# EAGLE design Project (EAGLE 6.5.0)
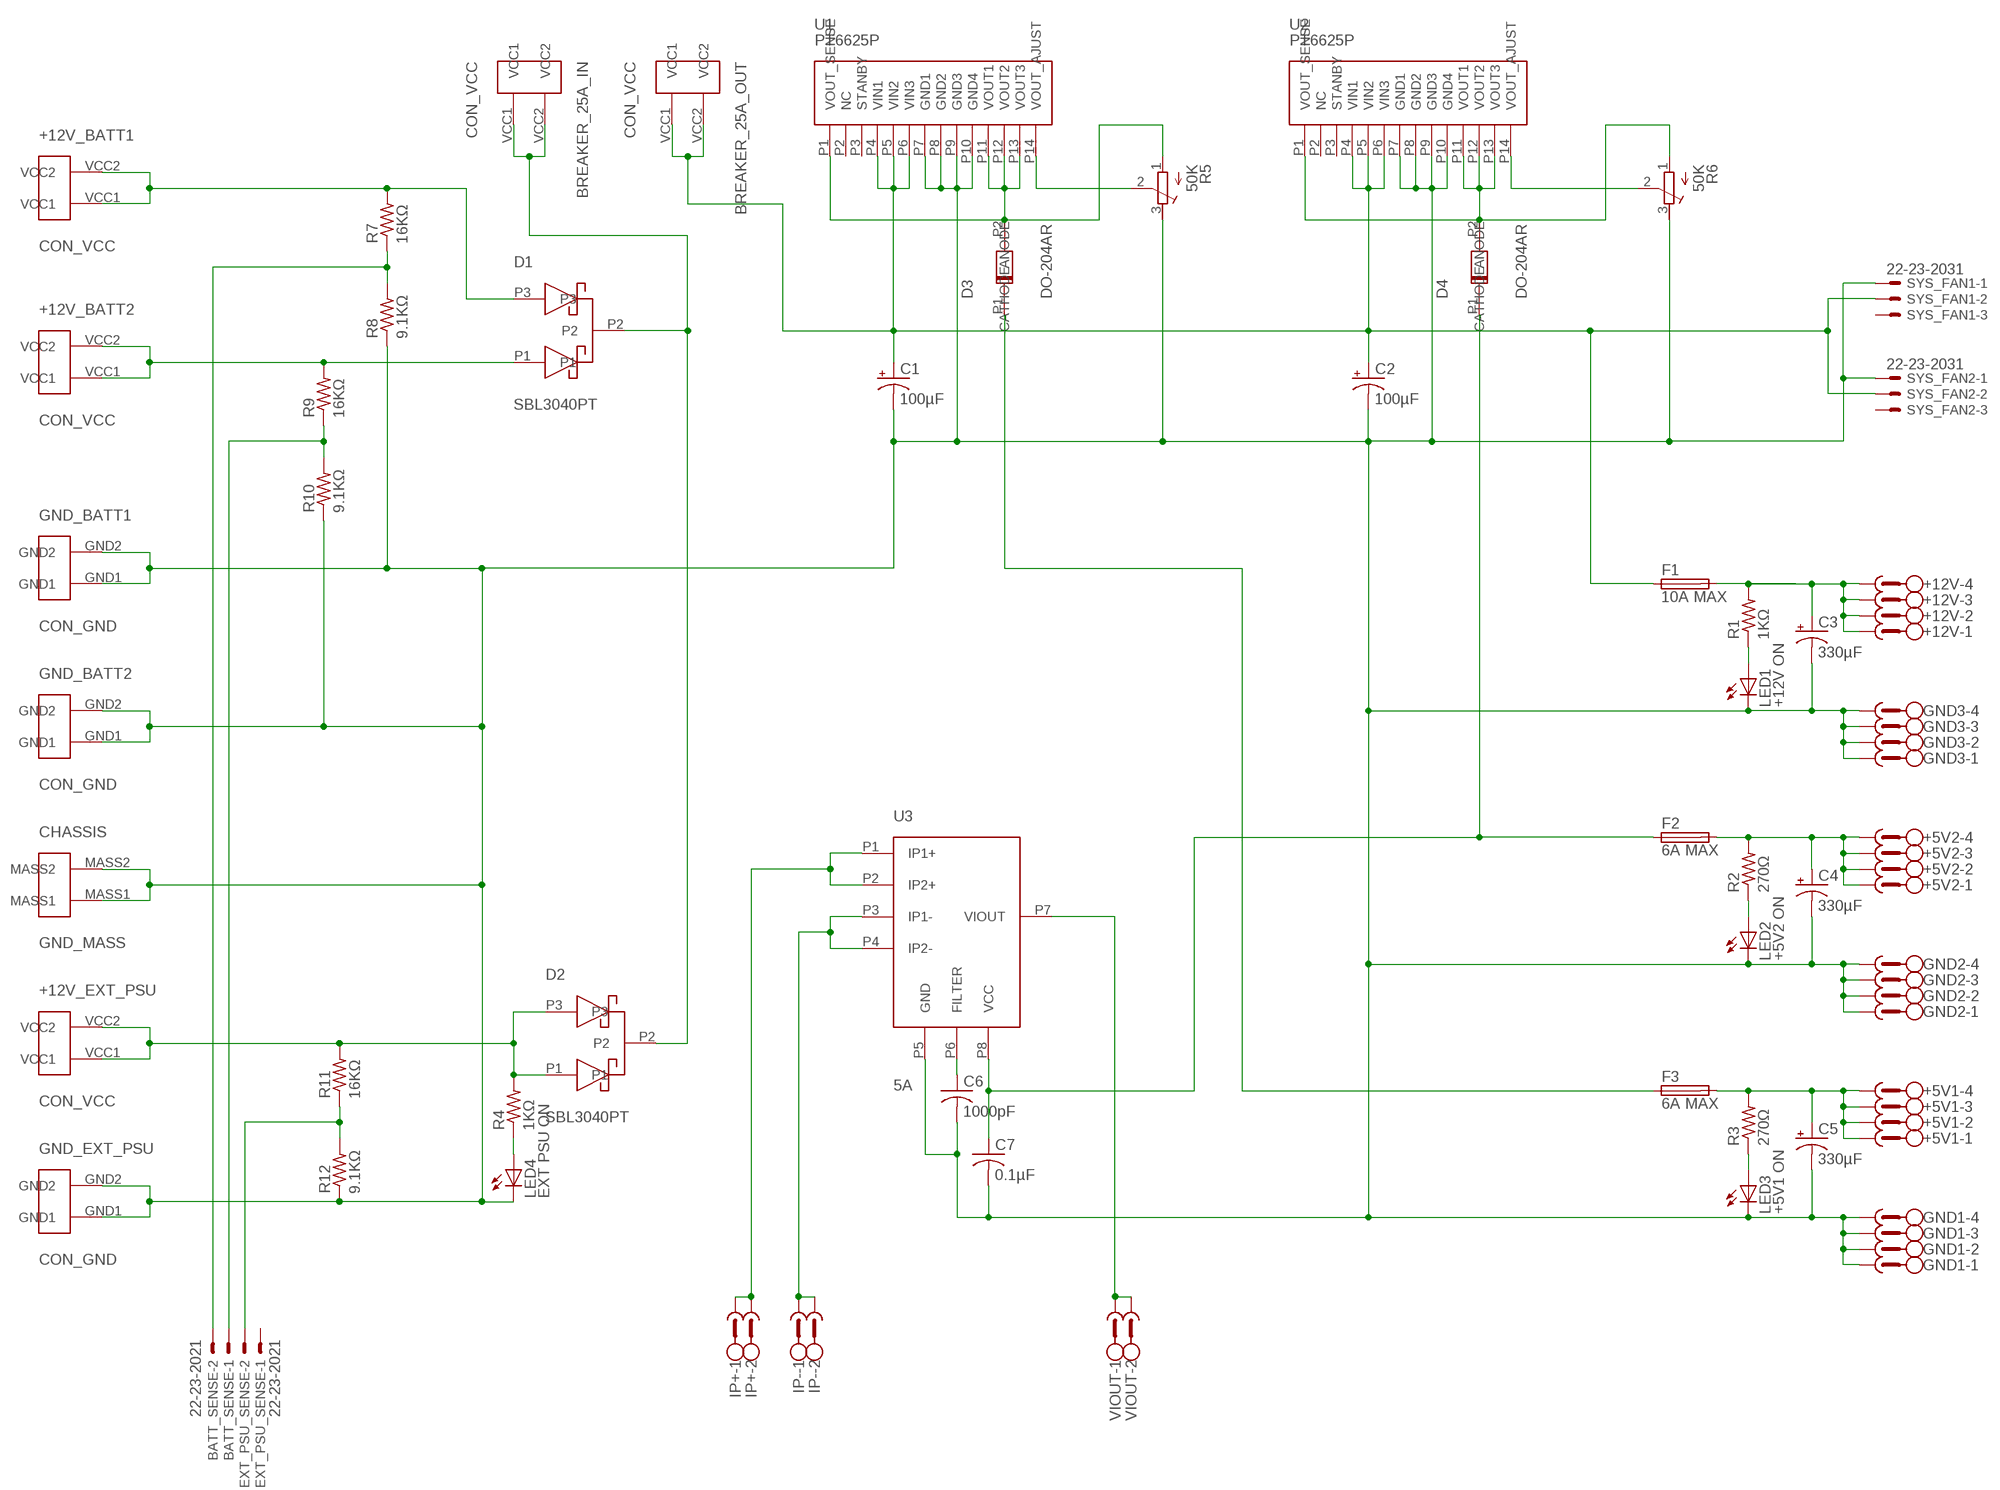
[diagram p0: schematic, sheet 1]

## Parts
+5V1  MC1.5/4-G-3.81  [MC1.5/4-G-3.81]
+5V2  MC1.5/4-G-3.81  [MC1.5/4-G-3.81]
+12V  MC1.5/4-G-3.81  [MC1.5/4-G-3.81]
+12V_BATT1  CON_VCC  [CON_VCC]
+12V_BATT2  CON_VCC  [CON_VCC]
+12V_EXT_PSU  CON_VCC  [CON_VCC]
BATT_SENSE  22-23-2021  [22-23-2021]
BREAKER_25A_IN  CON_VCC  [CON_VCC]
BREAKER_25A_OUT  CON_VCC  [CON_VCC]
C1  100µF  CPOL-USE2.5-6  [E2,5-6]
C2  100µF  CPOL-USE2.5-6  [E2,5-6]
C3  330µF  CPOL-USE5-10.5  [E5-10,5]
C4  330µF  CPOL-USE5-10.5  [E5-10,5]
C5  330µF  CPOL-USE5-10.5  [E5-10,5]
C6  1000pF  C-USC0805  [C0805]
C7  0.1µF  C-USC0805  [C0805]
CHASSIS  GND_MASS  [CON_MASS]
D1  SBL3040PT  [SBL3040PT]
D2  SBL3040PT  [SBL3040PT]
D3  DO-204AR  [DO-204AR]
D4  DO-204AR  [DO-204AR]
EXT_PSU_SENSE  22-23-2021  [22-23-2021]
F1  10A MAX  SH22,5  [SH22,5]
F2  6A MAX  SH22,5  [SH22,5]
F3  6A MAX  SH22,5  [SH22,5]
GND1  MC1.5/4-G-3.81  [MC1.5/4-G-3.81]
GND2  MC1.5/4-G-3.81  [MC1.5/4-G-3.81]
GND3  MC1.5/4-G-3.81  [MC1.5/4-G-3.81]
GND_BATT1  CON_GND  [CON_GND]
GND_BATT2  CON_GND  [CON_GND]
GND_EXT_PSU  CON_GND  [CON_GND]
IP+  MC1.5/2-G-3.81  [MC1.5/2-G-3.81]
IP-  MC1.5/2-G-3.81  [MC1.5/2-G-3.81]
LED1  +12V ON  LEDCHIP-LED0805  [CHIP-LED0805]
LED2  +5V2 ON  LEDCHIP-LED0805  [CHIP-LED0805]
LED3  +5V1 ON  LEDCHIP-LED0805  [CHIP-LED0805]
LED4  EXT PSU ON  LEDCHIP-LED0805  [CHIP-LED0805]
R1  1KΩ  R-US_M0805  [M0805]
R2  270Ω  R-US_M0805  [M0805]
R3  270Ω  R-US_M0805  [M0805]
R4  1KΩ  R-US_M0805  [M0805]
R5  50K  R-TRIMM3296Y  [RTRIM3296Y]
R6  50K  R-TRIMM3296Y  [RTRIM3296Y]
R7  16KΩ  R-US_R0805  [R0805]
R8  9.1KΩ  R-US_R0805  [R0805]
R9  16KΩ  R-US_R0805  [R0805]
R10  9.1KΩ  R-US_R0805  [R0805]
R11  16KΩ  R-US_R0805  [R0805]
R12  9.1KΩ  R-US_R0805  [R0805]
SYS_FAN1  22-23-2031  [22-23-2031]
SYS_FAN2  22-23-2031  [22-23-2031]
U1  PT6625P  [PT6625P]
U2  PT6625P  [PT6625P]
U3  5A  ACS712  [ACS712]
VIOUT  MC1.5/2-G-3.81  [MC1.5/2-G-3.81]

## Nets
GND: C1.- C2.- C3.- C4.- C5.- C6.2 C7.2 CHASSIS.MASS1 CHASSIS.MASS2 GND1.1 GND1.2 GND1.3 GND1.4 GND2.1 GND2.2 GND2.3 GND2.4 GND3.1 GND3.2 GND3.3 GND3.4 GND_BATT1.GND1 GND_BATT1.GND2 GND_BATT2.GND1 GND_BATT2.GND2 GND_EXT_PSU.GND1 GND_EXT_PSU.GND2 LED1.C LED2.C LED3.C LED4.C R5.3(A) R6.3(A) R8.1 R10.1 R12.1 SYS_FAN1.1 SYS_FAN2.1 U1.P7(GND1) U1.P8(GND2) U1.P9(GND3) U1.P10(GND4) U2.P7(GND1) U2.P8(GND2) U2.P9(GND3) U2.P10(GND4) U3.P5(GND)
N$1: LED3.A R3.1
N$2: BATT_SENSE.2 R7.1 R8.2
N$3: LED2.A R2.1
N$4: U3.P7(VIOUT) VIOUT.1 VIOUT.2
N$5: LED1.A R1.1
N$6: D4.P2(CATHODE) R6.1(E) U2.P1(VOUT_SENSE) U2.P11(VOUT1) U2.P12(VOUT2) U2.P13(VOUT3)
N$7: +12V_BATT1.VCC1 +12V_BATT1.VCC2 D1.P3 R7.2
N$8: +12V_BATT2.VCC1 +12V_BATT2.VCC2 D1.P1 R9.2
N$9: +5V2.1 +5V2.2 +5V2.3 +5V2.4 C4.+ F2.2 R2.2
N$10: BREAKER_25A_IN.VCC1 BREAKER_25A_IN.VCC2 D1.P2 D2.P2
N$11: +12V.1 +12V.2 +12V.3 +12V.4 C3.+ F1.2 R1.2
N$12: +12V_EXT_PSU.VCC1 +12V_EXT_PSU.VCC2 D2.P1 D2.P3 R4.2 R11.2
N$13: +5V1.1 +5V1.2 +5V1.3 +5V1.4 C5.+ F3.2 R3.2
N$14: LED4.A R4.1
N$15: IP-.1 IP-.2 U3.P3(IP1-) U3.P4(IP2-)
N$16: R5.2(S) U1.P14(VOUT_AJUST)
N$17: D3.P2(CATHODE) R5.1(E) U1.P1(VOUT_SENSE) U1.P11(VOUT1) U1.P12(VOUT2) U1.P13(VOUT3)
N$18: R6.2(S) U2.P14(VOUT_AJUST)
N$19: D3.P1(ANODE) F3.1
N$20: C6.1 U3.P6(FILTER)
N$21: BREAKER_25A_OUT.VCC1 BREAKER_25A_OUT.VCC2 C1.+ C2.+ F1.1 SYS_FAN1.2 SYS_FAN2.2 U1.P4(VIN1) U1.P5(VIN2) U1.P6(VIN3) U2.P4(VIN1) U2.P5(VIN2) U2.P6(VIN3)
N$22: C7.1 D4.P1(ANODE) F2.1 U3.P8(VCC)
N$23: IP+.1 IP+.2 U3.P1(IP1+) U3.P2(IP2+)
N$24: BATT_SENSE.1 R9.1 R10.2
N$25: EXT_PSU_SENSE.2 R11.1 R12.2
Unconnected: EXT_PSU_SENSE.1 SYS_FAN1.3 SYS_FAN2.3 U1.P2(NC) U1.P3(STANBY) U2.P2(NC) U2.P3(STANBY)

## Library data of the parts
+5V1 +5V2 +12V GND1-GND3 = Connecteurs_Introlab:MC1.5/4-G-3.81: Digi-Key Part Number 277-1208-ND Manufacturer Part Number 1803293 Description CONN HEADER RT ANG 4POS 3.81MM Goes with Digi-Key Part Number 277-1163-ND Manufacturer Part Number 1803594 Description CONN TERMBLOCK PLUG 4POS 3.81MM
+12V_BATT1 +12V_BATT2 +12V_EXT_PSU BREAKER_25A_IN BREAKER_25A_OUT = _Project:CON_VCC
BATT_SENSE EXT_PSU_SENSE = APC-con-molex:22-23-2021: .100" (2.54mm) Center Header - 2 Pin; MF: MOLEX; MPN: 22-23-2021; OC_FARNELL: 1462926; OC_NEWARK: 25C3832
C1-C5 = APC-resistor:CPOL-US: POLARIZED CAPACITOR, American symbol
C6 C7 = resistor:C-US: CAPACITOR, American symbol
CHASSIS = _Project:GND_MASS
D1 D2 = _Project:SBL3040PT
D3 D4 = _Project:DO-204AR
F1-F3 = APC-fuse:SH22,5: FUSE HOLDER grid 22,5 mm, OGN0031 8201, Schurter (Buerklin); MF: SCHURTER; MPN: 0031.8201; OC_FARNELL: 1162740; OC_NEWARK: 96F8317
GND_BATT1 GND_BATT2 GND_EXT_PSU = _Project:CON_GND
IP+ IP- VIOUT = Connecteurs_Introlab:MC1.5/2-G-3.81: Digi-Key Part Number 277-1206-ND Manufacturer Part Number 1803277 Description CONN HEADER RT ANG 2POS 3.81MM Goes with Digi-Key Part Number 277-1161-ND Manufacturer Part Number 1803578 Description CONN TERMBLOCK PLUG 2POS 3.81MM
LED1-LED4 = adafruit:LED: LED OSRAM: - CHIPLED LG R971, LG N971, LY N971, LG Q971, LY Q971, LO R971, LY R971 LH N974, LH R974 LS Q976, LO Q976, LY Q976 LO Q996 - Hyper CHIPLED LW Q18S LB Q993, LB Q99A, LB R99A - SideLED LS A670, LO A670, LY A670, LG A670, LP A670 LB A673, LV A673, LT A673, LW A673 LH A674 LY A675 LS A676, LA A676, LO A676, LY A676, LW A676 LS A679, LY A679, LG A679 - Hyper Micro SIDELED® LS Y876, LA Y876, LO Y876, LY Y876 LT Y87S - SmartLED LW L88C, LW L88S LB L89C, LB L89S, LG L890 LS L89K, LO L89K, LY L89K LS L896, LA L896, LO L896, LY L896 - TOPLED LS T670, LO T670, LY T670, LG T670, LP T670 LSG T670, LSP T670, LSY T670, LOP T670, LYG T670 LG T671, LOG T671, LSG T671 LB T673, LV T673, LT T673, LW T673 LH T674 LS T676, LA T676, LO T676, LY T676, LB T676, LH T676, LSB T676, LW T676 LB T67C, LV T67C, LT T67C, LS T67K, LO T67K, LY T67K, LW E67C LS E67B, LA E67B, LO E67B, LY E67B, LB E67C, LV E67C, LT E67C LW T67C LS T679, LY T679, LG T679 LS T770, LO T770, LY T770, LG T770, LP T770 LB T773, LV T773, LT T773, LW T773 LH T774 LS E675, LA E675, LY E675, LS T675 LS T776, LA T776, LO T776, LY T776, LB T776 LHGB T686 LT T68C, LB T68C - Hyper Mini TOPLED® LB M676 - Mini TOPLED Santana® LG M470 LS M47K, LO M47K, LY M47K Source: http://www.osram.convergy.de/
R1-R4 = adafruit:R-US_: RESISTOR, American symbol
R5 R6 = APC-resistor:R-TRIMM: Trimm resistor
R7-R12 = resistor:R-US_: RESISTOR, American symbol
SYS_FAN1 SYS_FAN2 = APC-con-molex:22-23-2031: .100" (2.54mm) Center Header - 3 Pin; MF: MOLEX; MPN: 22-23-2031; OC_FARNELL: 1462950; OC_NEWARK: 30C0862
U1 U2 = _Project:PT6625P
U3 = ACS712:ACS712: http://www.allegromicro.com/~/media/Files/Datasheets/ACS712-Datasheet.ashx

## Net classes
0 default: clearance 0.205 mm

## Board
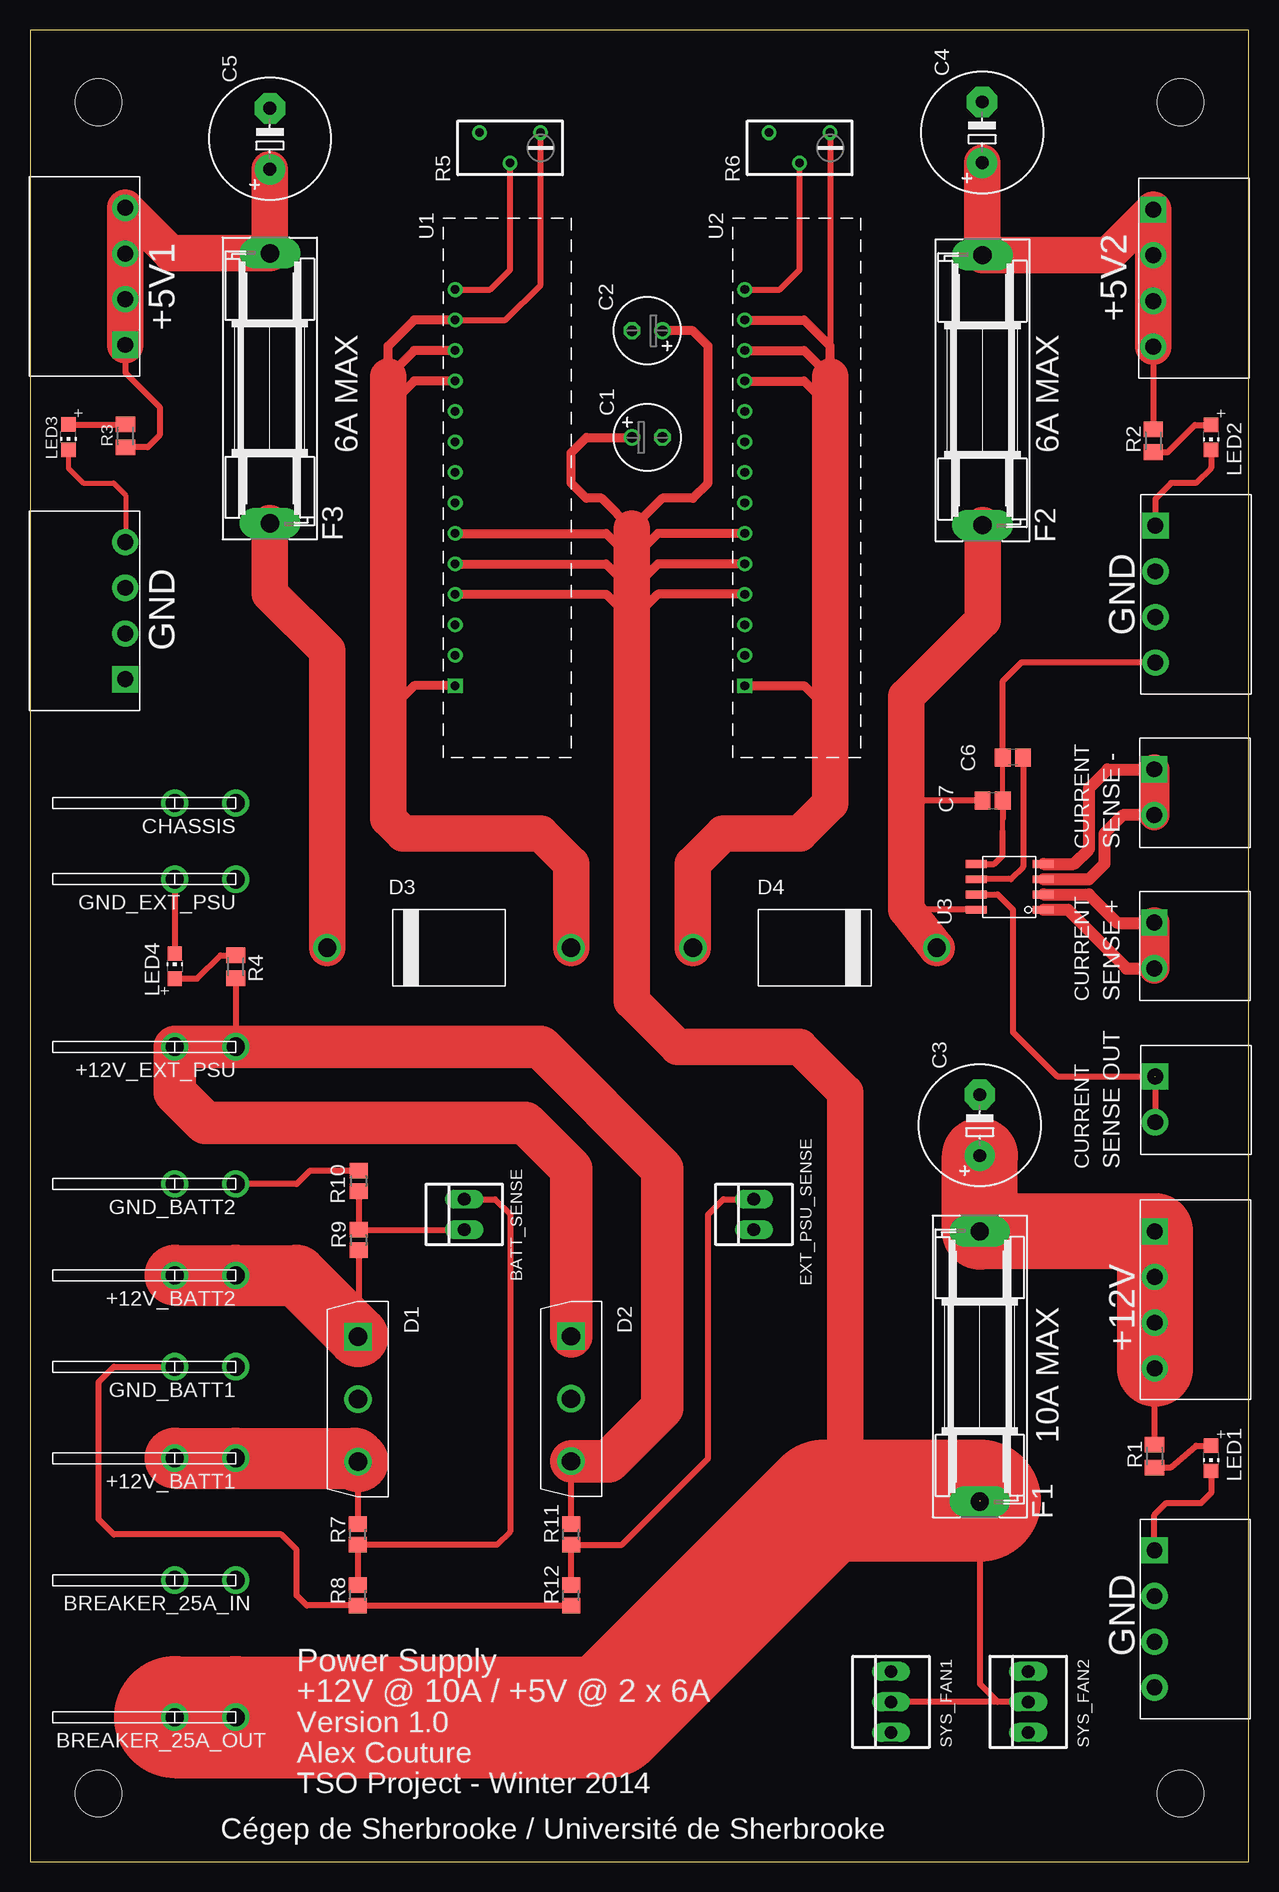
[diagram p1: board, top side]
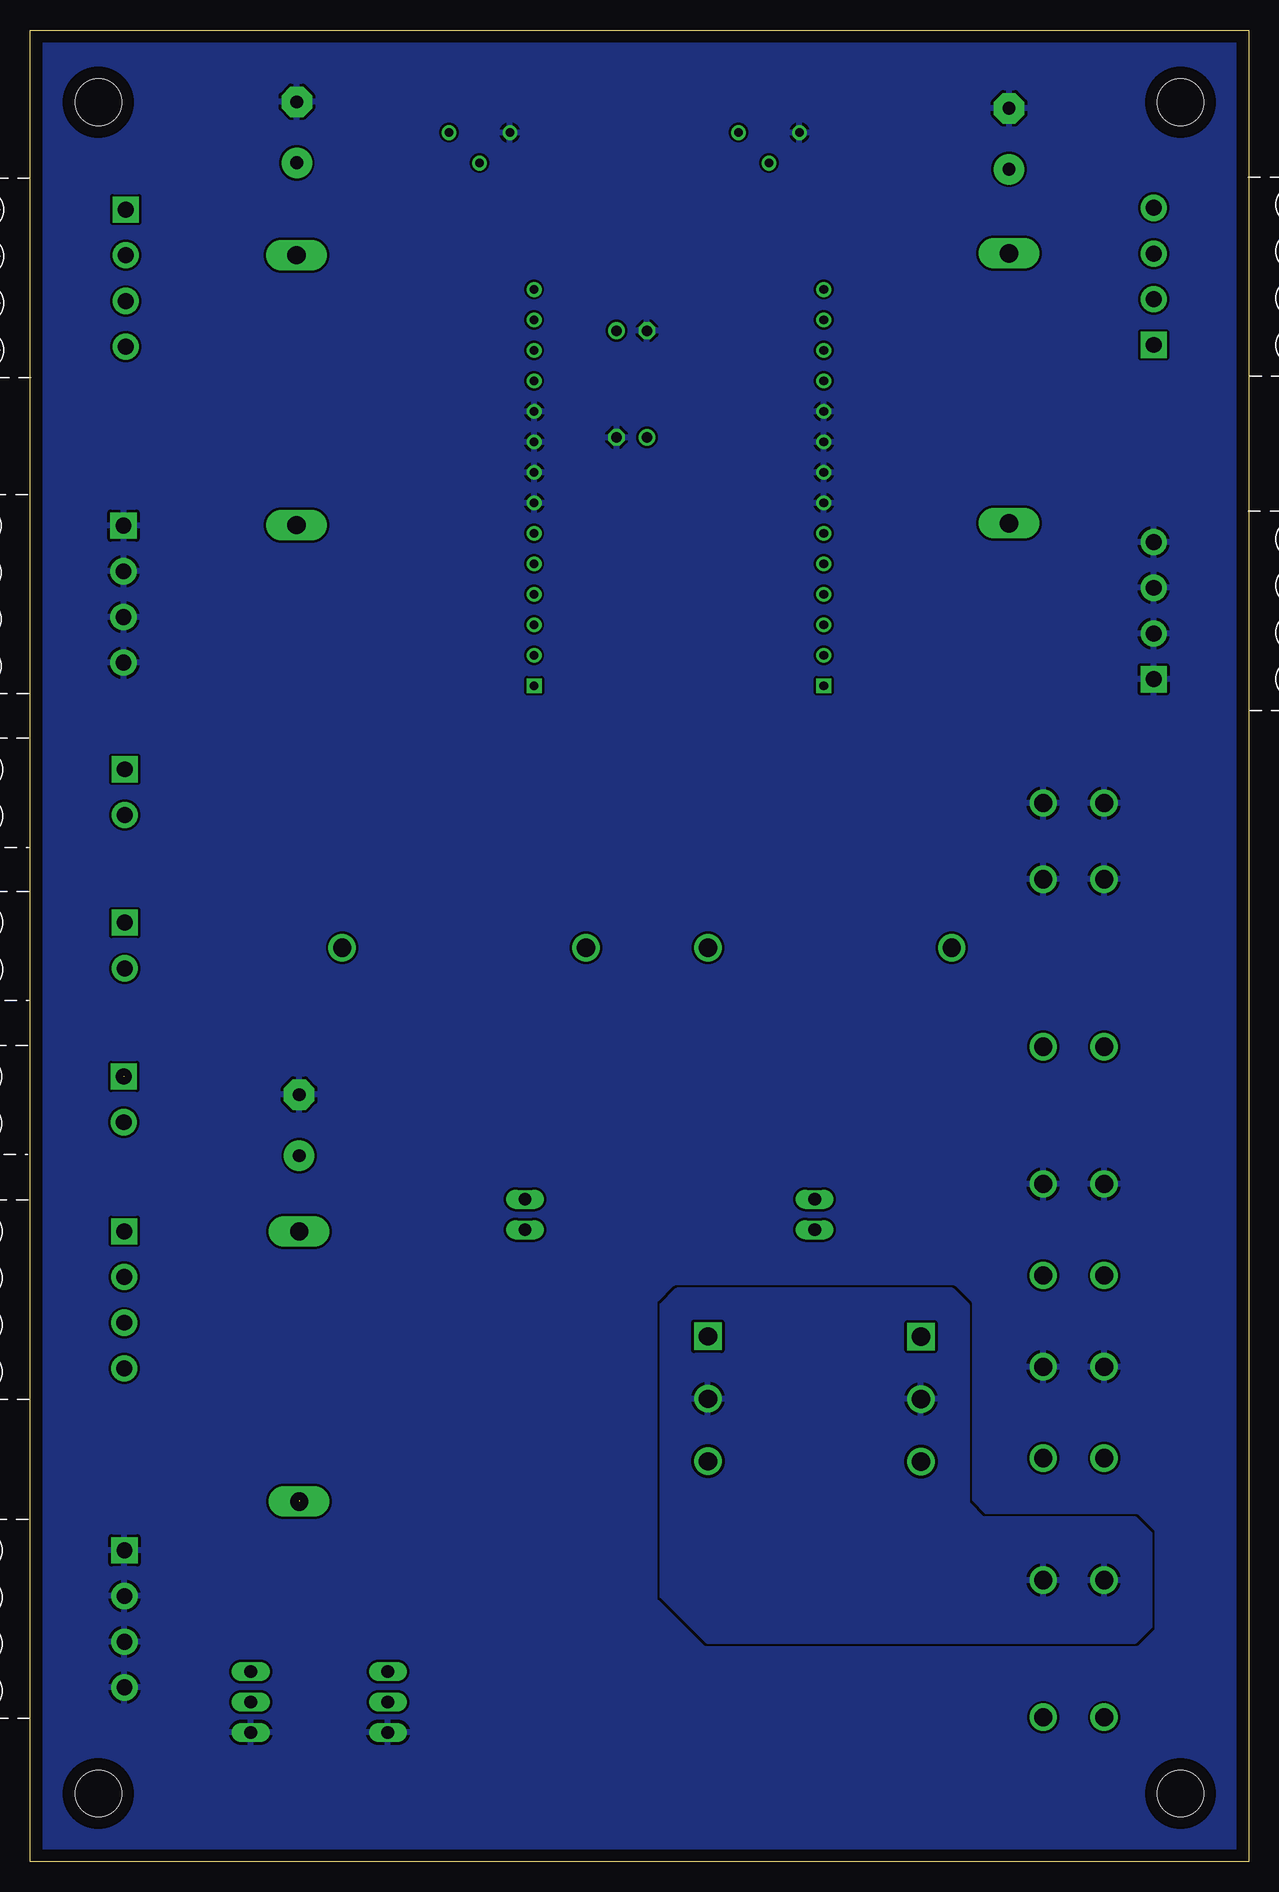
[diagram p2: board, bottom side, seen from below]

Size 101.58 x 152.71 mm. Coordinates in mm from the lower left corner, seen from the top.
Outline: 0,0 101.58,0 101.58,152.71 0,152.71 0,0
Copper layers (1*16): Top 0.035mm / dielectric 1.5mm / Bottom 0.035mm
Design rules "default *": minimum track width 10mil, minimum drill 20mil, track to track 8mil, track to pad 8mil, pad to pad 8mil, via to via 8mil, smd to smd 8mil, copper to edge 40mil, drill to drill 8mil, minimum pad ring 10mil, minimum via ring 8mil, stop-mask expansion 4mil, vias tented up to drill 0mil, thermal gap 10mil
Holes 3.86 mm at 5.71,5.71 5.71,146.69 95.89,146.69 95.89,5.71

### Footprints (pad centres in the part's own frame; a part is rotated, then mirrored left to right if it is on the bottom)
MC1.5/4-G-3.81 = drill 1.321 pad 2.184 square: 1 2.6,1.2 | drill 1.321 pad 2.184: 2 6.41,1.2; 3 10.22,1.2; 4 14.03,1.2
CON_VCC = drill 1.524: VCC1 0,0; VCC2 0,5.08
22-23-2021 = drill 1.067 long: 1 -1.27,0; 2 1.27,0
E2,5-6 = drill 0.889: + -1.27,0 | drill 0.889 octagon: - 1.27,0
E5-10,5 = drill 1.067 pad 2.54: + -2.54,0 | drill 1.067 pad 2.54 octagon: - 2.54,0
C0805 = smd 1.3 x 1.5: 1 -0.85,0; 2 0.85,0
CON_MASS = drill 1.524: MASS1 0,0; MASS2 0,5.08
SBL3040PT = drill 1.524 square: P1 0,0 | drill 1.524: P2 5.207,0; P3 10.414,0
DO-204AR = drill 1.524: P1 -10.16,3.175; P2 10.16,3.175
SH22,5 = drill 1.524 pad 2.54 long: 1 -11.252,0; 2 11.252,0
CON_GND = drill 1.524: GND1 0,0; GND2 0,5.08
MC1.5/2-G-3.81 = drill 1.321 pad 2.184 square: 1 2.6,1.2 | drill 1.321 pad 2.184: 2 6.41,1.2
CHIP-LED0805 = smd 1.2 x 1.2: A 0,-1.05; C 0,1.05
M0805 = smd 1.3 x 1.6: 1 -0.95,0; 2 0.95,0
RTRIM3296Y = drill 0.711: 1 1.27,-2.54; 2 -1.27,0; 3 1.27,2.54
R0805 = smd 1.3 x 1.5: 1 -0.85,0; 2 0.85,0
22-23-2031 = drill 1.067 long: 1 -2.54,0; 2 0,0; 3 2.54,0
PT6625P = drill 0.711 square: P1 5.969,9.652 | drill 0.711: P2 8.509,9.652; P3 11.049,9.652; P4 13.589,9.652; P5 16.129,9.652; P6 18.669,9.652; P7 21.209,9.652; P8 23.749,9.652; P9 26.289,9.652; P10 28.829,9.652; P11 31.369,9.652; P12 33.909,9.652; P13 36.449,9.652; P14 38.989,9.652
ACS712 = smd 0.65 x 1.75: P1 0,0; P2 1.27,0; P3 2.54,0; P4 3.81,0; P5 3.81,5.6; P6 2.54,5.6; P7 1.27,5.6; P8 0,5.6

### Placement (x,y rotation side)
+5V1  9.14,123.85 90 top
+5V2  92.41,140.34 270 top
+12V  92.53,55.17 270 top
+12V_BATT1  17.14,33.66 90 top
+12V_BATT2  17.14,48.89 90 top
+12V_EXT_PSU  17.14,67.94 90 top
BATT_SENSE  36.2,53.97 90 top
BREAKER_25A_IN  17.14,23.5 90 top
BREAKER_25A_OUT  17.14,12.06 90 top
C1  51.44,118.75 0 top
C2  51.44,127.64 180 top
C3  79.15,61.42 90 top
C4  79.35,144.17 90 top
C5  19.99,143.64 90 top
C6  81.92,92.08 180 top
C7  80.21,88.47 0 top
CHASSIS  17.14,88.27 90 top
D1  27.33,43.79 270 top
D2  45.08,43.81 270 top
D3  34.92,73.03 0 top
D4  65.41,79.38 180 top
EXT_PSU_SENSE  60.33,53.97 90 top
F1  79.15,41.3 90 top
F2  79.38,122.68 90 top
F3  19.99,122.83 90 top
GND1  9.14,95.99 90 top
GND2  92.58,114 270 top
GND3  92.51,28.57 270 top
GND_BATT1  17.14,41.28 90 top
GND_BATT2  17.14,56.52 90 top
GND_EXT_PSU  17.14,81.92 90 top
IP+  92.48,80.9 270 top
IP-  92.48,93.68 270 top
LED1  98.42,33.66 180 top
LED2  98.42,118.75 180 top
LED3  3.2,118.77 180 top
LED4  12.06,74.68 0 top
R1  93.7,33.83 90 top
R2  93.6,118.47 90 top
R3  7.95,118.87 270 top
R4  17.14,74.63 270 top
R5  40,142.88 90 top
R6  64.14,142.88 90 top
R7  27.3,27.3 90 top
R8  27.3,22.23 90 top
R9  27.38,51.84 270 top
R10  27.38,56.77 270 top
R11  45.08,27.3 90 top
R12  45.08,22.23 90 top
SYS_FAN1  71.76,13.34 90 top
SYS_FAN2  83.19,13.34 90 top
U1  45.08,92.08 90 top
U2  69.22,92.08 90 top
U3  84.45,79.38 90 top
VIOUT  92.56,68.07 270 top

### Tracks (layer width: path | path; a pad name or v marks a point on that pad's centre or on a via)
GND
  Top 0.406: GND2.1 | 81.05,85.92 C7.2 | 81.06,86.99 C6.2 | LED3.C 3.2,116.18 4.45,114.94 6.96,114.94 7.98,113.92 7.98,110.05 GND1.4
  Top 0.508: LED2.C 98.42,116.2 97.16,114.94 95.1,114.94 93.78,113.61 GND2.1 | LED1.C 98.42,30.76 97.59,29.92 94.69,29.92 93.7,28.93 GND3.1 | U3.P5 80.34,83.19 81.05,83.9 81.05,85.92 | C7.2 81.06,86.99 | C6.2 81.06,98.44 82.63,100 93.75,100 GND2.4 | GND_EXT_PSU.GND2 LED4.C | R10.1 23.33,57.62 22.23,56.52 GND_BATT2.GND1 | R12.1 R8.1 23.07,21.38 22.23,22.23 22.23,26.04 20.95,27.3 6.98,27.3 5.71,28.57 5.71,40 6.98,41.28 GND_BATT1.GND2
  pour Bottom (rank 2): 0,152.7 101.57,152.7 101.57,0 0,0
N$1
  Top 0.508: LED3.A R3.1
N$2
  Top 0.508: R8.2 R7.1 27.32,26.44 38.91,26.44 40,27.53 40,53.97 38.73,55.25 BATT_SENSE.2
N$3
  Top 0.406: LED2.A
  Top 0.508: R2.1 94.81,117.52 97.08,119.79 LED2.A
N$4  (1 unrouted)
  Top 0.508: U3.P7 80.65,80.65 81.92,79.38 81.92,69.16 85.6,65.48 VIOUT.1 VIOUT.2
N$5
  Top 0.508: R1.1 95.1,32.89 97.18,34.7 LED1.A
N$6
  Top 0.508: R6.1 66.67,126.37
  Top 0.762: U2.P12 64.52,125.98 66.67,123.83 66.67,126.37 64.52,128.52 U2.P13 | U2.P11 64.52,123.44 66.67,121.28 | U2.P1 64.52,98.04 66.67,95.89
  Top 3.048: 66.67,123.83 66.67,121.28 66.67,95.89 66.67,88.27 64.14,85.73 57.78,85.73 55.25,83.19 D4.P2
N$7
  Top 0.508: D1.P3 27.33,28.18 R7.2
  Top 5.08: +12V_BATT1.VCC2 +12V_BATT1.VCC1 27.05,33.66 D1.P3
N$8
  Top 0.508: R9.2 27.38,43.84 D1.P1
  Top 5.08: D1.P1 22.23,48.89 +12V_BATT2.VCC1 +12V_BATT2.VCC2
N$9
  Top 0.406: R2.2
  Top 0.508: +5V2.4 R2.2
  Top 3.048: +5V2.2 +5V2.1 89.8,133.93 F2.2 79.35,133.96 C4.+ | +5V2.2 +5V2.3 +5V2.4 | +5V2.2
N$10
  pour Bottom (isolate 0.254): 23.5,46.36 24.77,47.62 47.62,47.62 48.89,46.36 48.89,22.23 45.08,18.41 9.53,18.41 8.25,19.69 8.25,27.3 9.53,28.57 22.23,28.57 23.5,29.84
N$11
  Top 0.508: +12V.4 R1.2
  Top 6.35: +12V.4 +12V.3 +12V.2 +12V.1 79.16,52.57 F1.2 C3.+
N$12
  Top 0.508: R4.2 +12V_EXT_PSU.VCC1 | R11.2 D2.P3
  Top 3.556: D2.P3 48.23,33.4 52.7,37.87 52.7,57.78 42.55,67.94 +12V_EXT_PSU.VCC1 +12V_EXT_PSU.VCC2 12.06,64.14 14.61,61.59 41.28,61.59 45.08,57.78 D2.P1
N$13
  Top 0.406: R3.2
  Top 0.508: +5V1.1 7.94,124.14 10.79,121.28 10.79,118.92 9.8,117.93 R3.2
  Top 3.048: +5V1.1 +5V1.2 +5V1.3 +5V1.4 11.74,134.09 F3.2 C5.+
N$14
  Top 0.508: LED4.A 13.94,73.63 15.88,75.56 R4.1
N$15
  Top 1.016: IP-.2 91.08,87.27 89.53,85.73 89.53,83.19 88.27,81.92 U3.P3 | U3.P4 87,83.19 88.27,84.45 88.27,89.53 89.81,91.08 IP-.1
  Top 2.54: IP-.1 IP-.2
N$16
  Top 0.508: U1.P14 38.35,131.06 40,132.72 R5.2
N$17
  Top 0.508: U1.P13 39.62,128.52 42.55,131.44 R5.1
  Top 0.762: U1.P13 32,128.52 29.84,126.37 29.84,123.83 32,125.98 U1.P12 | U1.P11 32,123.44 29.84,121.28 | U1.P1 32,98.04 29.84,95.89
  Top 3.048: 29.84,123.83 29.84,121.28 29.84,95.89 29.84,87 31.11,85.73 42.55,85.73 45.08,83.19 D3.P2
N$18
  Top 0.508: U2.P14 62.48,131.06 64.14,132.72 R6.2
N$19
  Top 3.048: D3.P1 24.77,100.97 19.99,105.74 F3.1
N$20
  Top 0.508: C6.1 82.77,82.94 81.74,81.92 U3.P6
N$21  (1 unrouted)
  Top 0.508: SYS_FAN2.2 80.65,13.34 | 80.65,13.34 SYS_FAN1.2 | 79.15,30.12 79.15,14.83 80.65,13.34
  Top 0.762: U2.P6 52.32,110.74 50.17,108.59 48.01,110.74 U1.P6 | U2.P5 52.32,108.2 50.17,106.05 48.01,108.2 U1.P5 | U1.P4 48.01,105.66 50.17,103.51 52.32,105.66 U2.P4 | C1.+ 50.17,118.72 46.38,118.72 46.36,118.75 45.08,117.48 45.08,114.94 46.36,113.67 47.62,113.67 50.17,111.12 52.7,113.67 55.25,113.67 56.52,114.94 56.52,126.37 55.25,127.64 C2.+
  Top 10.16: BREAKER_25A_OUT.VCC2 BREAKER_25A_OUT.VCC1 48.11,12.06 66.17,30.12 71.76,30.12 79.15,30.12
  Top 3.048: 50.17,111.12 50.17,108.59 50.17,106.05 50.17,103.51 50.17,71.76 53.97,67.94 64.14,67.94 67.94,64.14 67.94,33.93 71.76,30.12
N$22
  Top 0.508: C7.1 74.5,88.47 73.03,87 | U3.P8 73.03,79.38
  Top 3.048: D4.P1 73.03,79.38 73.03,87 73.03,97.16 79.38,103.51 F2.1
N$23
  Top 1.016: U3.P2 88.24,80.65 90.6,78.28 93.67,78.28 IP+.1 | U3.P1 86.49,79.38 91.39,74.47 93.67,74.47 IP+.2
  Top 2.54: IP+.1 IP+.2
N$24
  Top 0.508: R10.2 R9.1 36.18,52.69 BATT_SENSE.1
N$25
  Top 0.508: R12.2 R11.1 49.31,26.45 56.52,33.66 56.52,53.97 57.78,55.25 EXT_PSU_SENSE.2

### Text on the board
tPlace: +5V2 | +5V1 | 6A MAX | 6A MAX | GND | GND | CURRENT | SENSE - | CURRENT | SENSE + | CURRENT | SENSE OUT | +12V | 10A MAX | GND | Power Supply | +12V @ 10A / +5V @ 2 x 6A | Version 1.0 | Alex Couture | TSO Project - Winter 2014 | Cégep de Sherbrooke / Université de Sherbrooke